# Altium schematic sheet tscnew.SchDoc
size A3
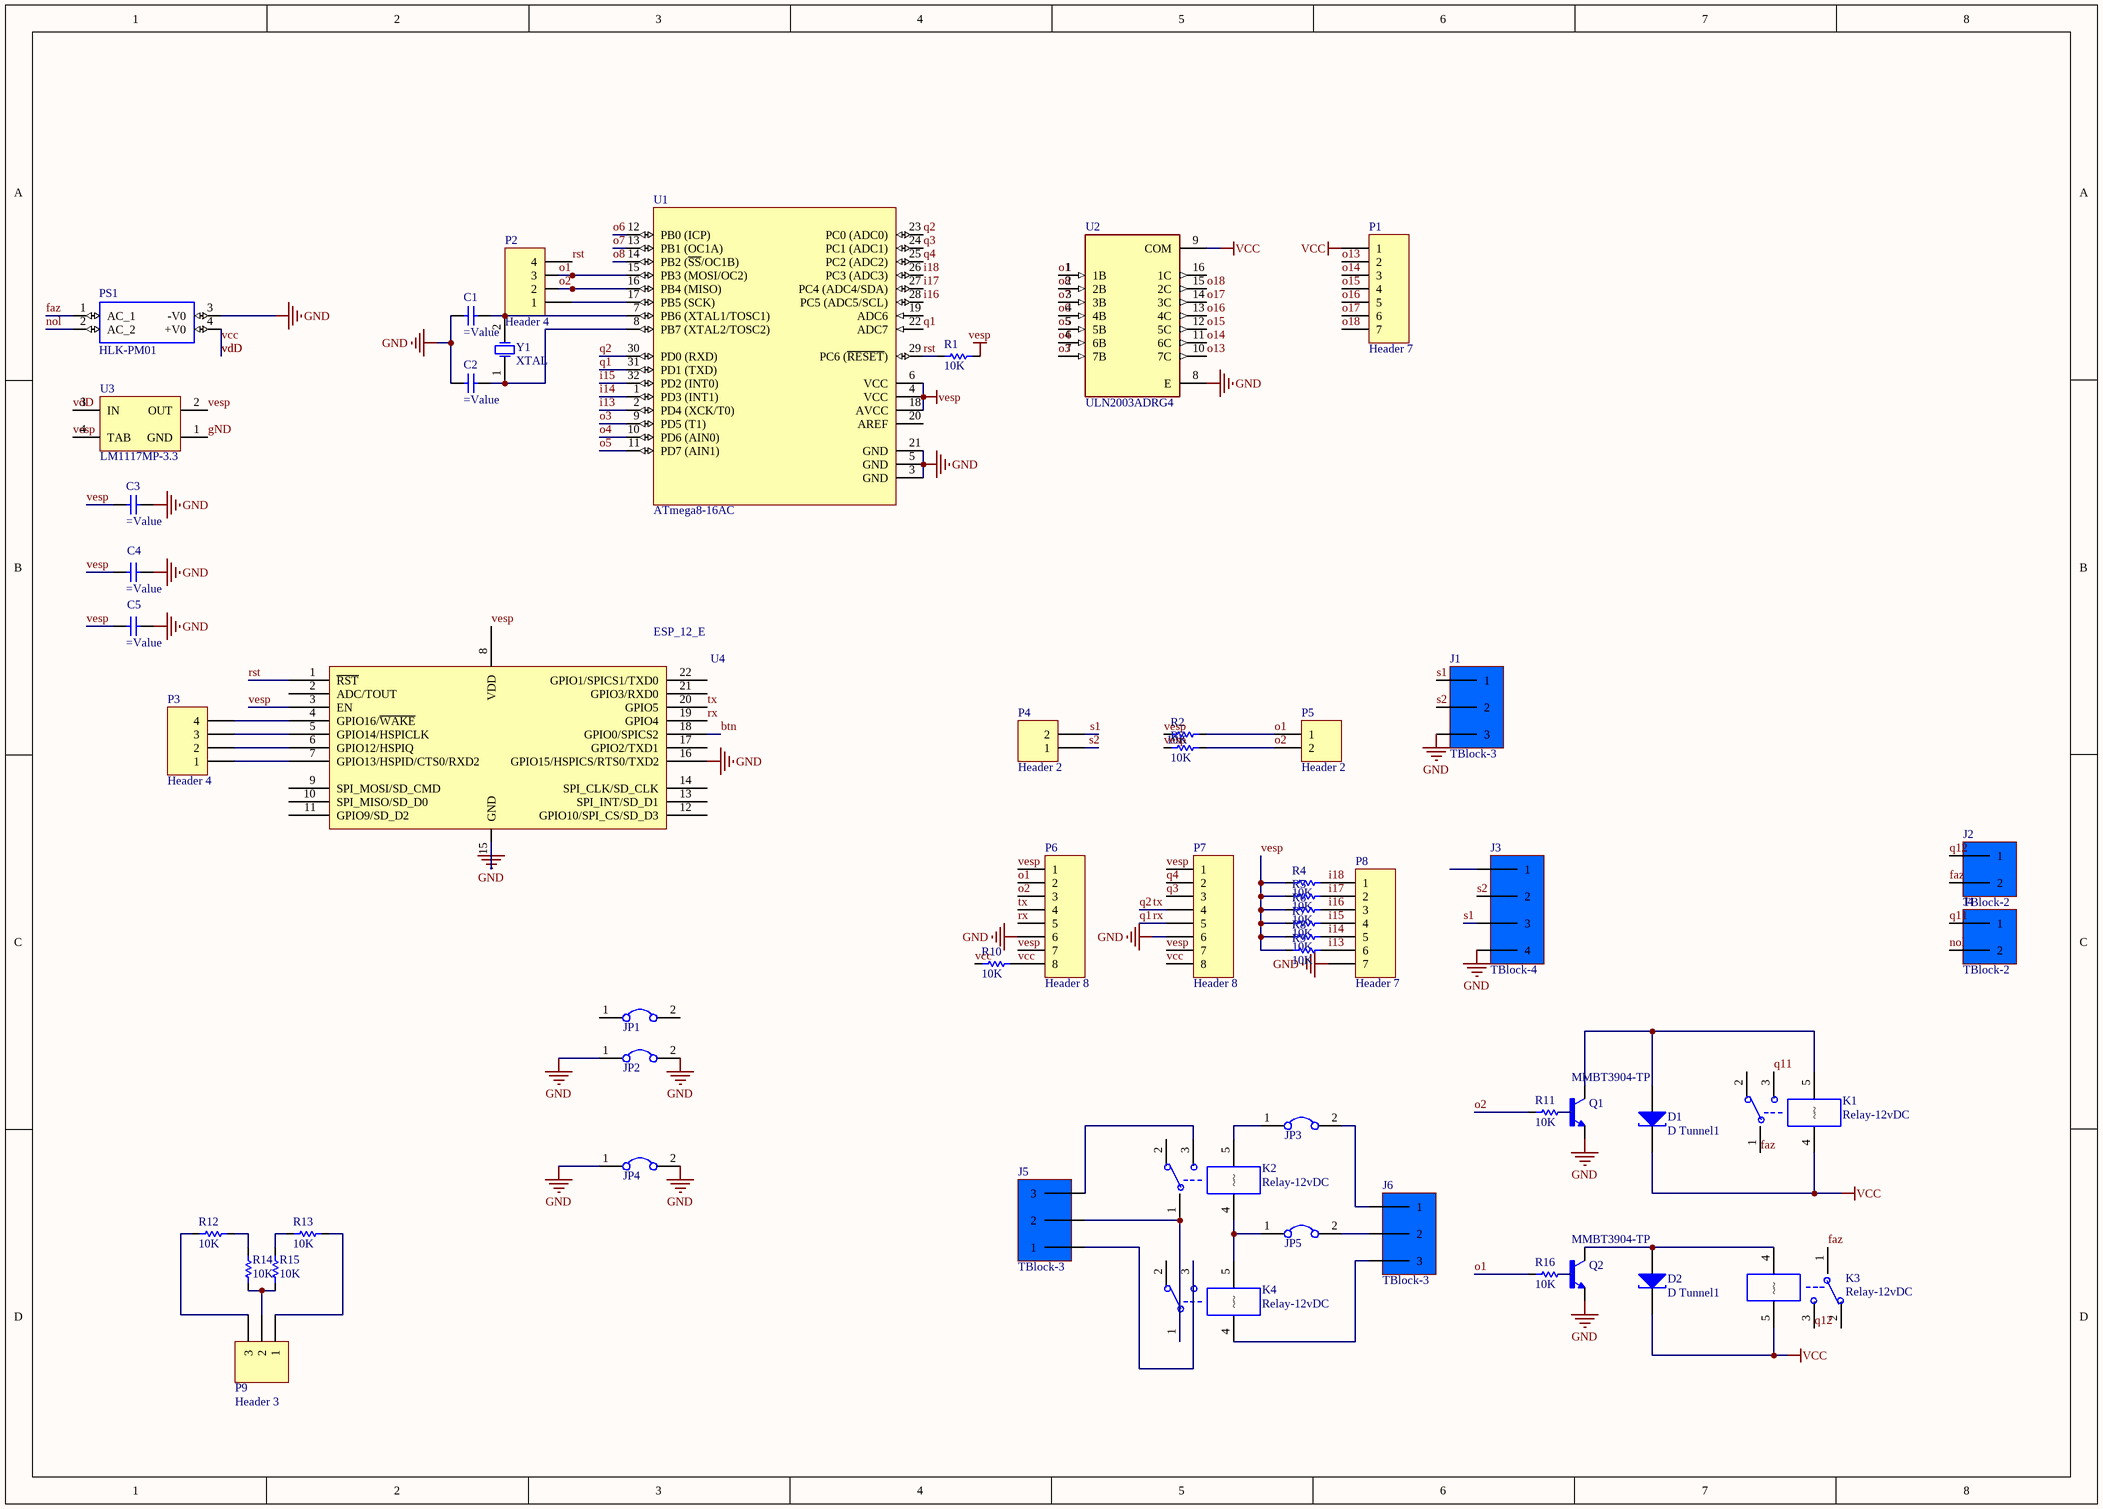
[diagram p0: tscnew.SchDoc]

## Parts
C1  (no value)  [CAP 0805]
C2  (no value)  [CAP 0805]
C3  (no value)  [CAP 0805]
C4  (no value)  [CAP 0805]
C5  (no value)  [CAP 0805]
D1  D Tunnel1  [3.2X1.6X1.1]
D2  D Tunnel1  [3.2X1.6X1.1]
J1  TBlock-3  [KF300-3 PIN]
J2  TBlock-2  [KF300-2 PIN]
J3  TBlock-4  [KF300-4 PIN]
J4  TBlock-2  [KF300-2 PIN]
J5  TBlock-3  [KF300-3 PIN]
J6  TBlock-3  [KF300-3 PIN]
JP1  Jumper  [Header 2X1]  (value not drawn)
JP2  Jumper  [Header 2X1]  (value not drawn)
JP3  Jumper  [Header 2X1]  (value not drawn)
JP4  Jumper  [Header 2X1]  (value not drawn)
JP5  Jumper  [Header 2X1]  (value not drawn)
K1  Relay-12vDC  [Relays]
K2  Relay-12vDC  [Relays]
K3  Relay-12vDC  [Relays]
K4  Relay-12vDC  [Relays]
P1  Header 7  [HDR1X7]
P2  Header 4  [HDR1X4]
P3  Header 4  [HDR1X4]
P4  Header 2  [HDR1X2]
P5  Header 2  [HDR1X2]
P6  Header 8  [HDR1X8]
P7  Header 8  [HDR1X8]
P8  Header 7  [HDR1X7]
P9  Header 3  [HDR1X3]
PS1  HLK-PM01  [HLKPM01]
Q1  MMBT3904-TP  [SOT23-3]
Q2  MMBT3904-TP  [SOT23-3]
R1  10K  [RES 1206 (3216X08L)]
R2  10K  [RES 1206 (3216X08L)]
R3  10K  [RES 0805 (2012X06L)]
R4  10K  [RES 0805 (2012X06L)]
R5  10K  [RES 0805 (2012X06L)]
R6  10K  [RES 0805 (2012X06L)]
R7  10K  [RES 0805 (2012X06L)]
R8  10K  [RES 0805 (2012X06L)]
R9  10K  [RES 0805 (2012X06L)]
R10  10K  [Res-(1/4)]
R11  10K  [RES 0805 (2012X06L)]
R12  10K  [RES 0805 (2012X06L)]
R13  10K  [RES 0805 (2012X06L)]
R14  10K  [RES 0603 (1608X06L)]
R15  10K  [RES 0603 (1608X06L)]
R16  10K  [RES 0805 (2012X06L)]
U1  ATmega8-16AC  [32A_N]
U2  ULN2003ADRG4  [SOIC127P600X175-16N]
U3  LM1117MP-3.3  [MP04A_N]
U4  ESP_12_E  [ESP_12_E]
Y1  XTAL  [R38]

## Nets
gND: C1.1(+) C2.1(+) C3.2(-) C4.2(-) C5.2(-) J1.3 J3.4 JP2.1 JP2.2 JP4.1 JP4.2 P6.6 P7.6 P8.7 PS1.3(-V0) Q1.2(E) Q2.2(E) U1.3(GND) U1.5(GND) U1.21(GND) U2.8(E) U3.1(GND) U4.15(GND) U4.16(GPIO15/HSPICS/RTS0/TXD2)
vcc: D1.2(K) D2.2(K) K1.4 K3.5 P1.1 P6.8 P7.8 PS1.4(+V0) R10.1 R10.2 U2.9(COM) U3.3(IN)  [also labelled vdD]
vesp: C3.1(+) C4.1(+) C5.1(+) P6.1 P6.7 P7.1 P7.7 R1.2 R2.1 R3.1 R4.1 R5.1 R6.1 R7.1 R8.1 R9.1 U1.4(VCC) U1.6(VCC) U1.18(AVCC) U3.2(OUT) U3.4(TAB) U4.3(EN) U4.8(VDD)
btn: U4.18(GPIO0/SPICS2)
faz: J2.2 K1.1(COM) K3.1(COM) PS1.1(AC_1)
i13: P8.6 R9.2 U1.2(PD4_(XCK/T0))
i14: P8.5 R8.2 U1.1(PD3_(INT1))
i15: P8.4 R7.2 U1.32(PD2_(INT0))
i16: P8.3 R6.2 U1.28(PC5_(ADC5/SCL))
i17: P8.2 R5.2 U1.27(PC4_(ADC4/SDA))
i18: P8.1 R4.2 U1.26(PC3_(ADC3))
nol: J4.2 PS1.2(AC_2)
o1: P2.3 P5.1 P6.2 R2.2 R16.1 U1.15(PB3_(MOSI/OC2)) U2.1(1B)
o2: P2.2 P5.2 P6.3 R3.2 R11.1 U1.16(PB4_(MISO))
o3: U1.9(PD5_(T1)) U2.7(7B)
o4: U1.10(PD6_(AIN0)) U2.6(6B)
o5: U1.11(PD7_(AIN1)) U2.5(5B)
o6: U1.12(PB0_(ICP)) U2.4(4B)
o7: U1.13(PB1_(OC1A)) U2.3(3B)
o8: U1.14(PB2_(~{SS}/OC1B)) U2.2(2B)
o13: P1.2 U2.10(7C)
o14: P1.3 U2.11(6C)
o15: P1.4 U2.12(5C)
o16: P1.5 U2.13(4C)
o17: P1.6 U2.14(3C)
o18: P1.7 U2.15(2C)
q1: P6.5 P7.5 U1.22(ADC7) U1.31(PD1_(TXD)) U4.19(GPIO4)  [also labelled rx]
q2: P6.4 P7.4 U1.23(PC0_(ADC0)) U1.30(PD0_(RXD)) U4.20(GPIO5)  [also labelled tx]
q3: P7.3 U1.24(PC1_(ADC1))
q4: P7.2 U1.25(PC2_(ADC2))
q11: J4.1 K1.3(NO)
q12: J2.1 K3.3(NO)
rst: P2.4 R1.1 U1.29(PC6_(~{RESET})) U4.1(~{RST})
s1: J1.1 J3.3 P4.2
s2: J1.2 J3.2 P4.1
NetC1_2: C1.2(-) U1.7(PB6_(XTAL1/TOSC1)) Y1.2(OSC2)
NetC2_2: C2.2(-) U1.8(PB7_(XTAL2/TOSC2)) Y1.1(OSC1)
NetD1_1: D1.1(A) K1.5 Q1.3(C)
NetD2_1: D2.1(A) K3.4 Q2.3(C)
NetJ5_1: J5.1 K4.3(NO)
NetJ5_2: J5.2 K2.1(COM) K4.1(COM)
NetJ5_3: J5.3 K2.3(NO)
NetJ6_1: J6.1 JP3.2
NetJ6_2: J6.2 JP5.2
NetJ6_3: J6.3 K4.4
NetJP3_1: JP3.1 K2.5
NetJP5_1: JP5.1 K2.4 K4.5
NetP2_1: P2.1 U1.17(PB5_(SCK))
NetP3_1: P3.1 U4.7(GPIO13/HSPID/CTS0/RXD2)
NetP3_2: P3.2 U4.6(GPIO12/HSPIQ)
NetP3_3: P3.3 U4.5(GPIO14/HSPICLK)
NetP3_4: P3.4 U4.4(GPIO16/~{WAKE})
NetP9_1: P9.1 R13.2
NetP9_2: P9.2 R14.1 R15.1
NetP9_3: P9.3 R12.1
NetQ1_1: Q1.1(B) R11.2
NetQ2_1: Q2.1(B) R16.2
NetR12_2: R12.2 R14.2
NetR13_1: R13.1 R15.2

Not connected (* = marked no-connect by the designer): J3 1; JP1 1 2; K1 2(NC); K2 2(NC); K3 2(NC); K4 2(NC); U1 19(ADC6) 20(AREF); U2 16(1C); U4 2(ADC/TOUT) 9(SPI_MOSI/SD_CMD) 10(SPI_MISO/SD_D0) 11(GPIO9/SD_D2) 12(GPIO10/SPI_CS/SD_D3) 13(SPI_INT/SD_D1) 14(SPI_CLK/SD_CLK) 17(GPIO2/TXD1) 21(GPIO3/RXD0) 22(GPIO1/SPICS1/TXD0)

## Library data of the parts
C1-C5 = Capacitor
D1 D2 = D Tunnel1: Tunnel Diode - RLC Model; Published: 8-Jun-2000; LatestRevisionDate: 17-Jul-2002; LatestRevisionNote: Re-released for DXP Platform.; PackageVersion: Feb-2002; PackageReference: 3.2X1.6X1.1; Publisher: Altium Limited; PackageDescription: SM LED; 2 Flat Leads
K1-K4 = Relay-05vDC: Relay-05vDC-240AC 5A; Designer: Seyed Mohsen Ghasemain; ComponentLinkURL: www.picpars.com
P1 P8 = Header 7: Header, 7-Pin; LatestRevisionDate: 17-Jul-2002; LatestRevisionNote: Re-released for DXP Platform.; Publisher: Altium Limited
P2 P3 = Header 4: Header, 4-Pin; LatestRevisionDate: 17-Jul-2002; LatestRevisionNote: Re-released for DXP Platform.; Publisher: Altium Limited
P4 P5 = Header 2: Header, 2-Pin; LatestRevisionDate: 17-Jul-2002; LatestRevisionNote: Re-released for DXP Platform.; Publisher: Altium Limited
P6 P7 = Header 8: Header, 8-Pin; LatestRevisionDate: 17-Jul-2002; LatestRevisionNote: Re-released for DXP Platform.; Publisher: Altium Limited
P9 = Header 3: Header, 3-Pin; LatestRevisionDate: 17-Jul-2002; LatestRevisionNote: Re-released for DXP Platform.; Publisher: Altium Limited
PS1 = HLK-PM01: <b>Ultra-compact power module</b><p> Source: <a href="https://datasheet.lcsc.com/szlcsc/1906201102_HI-LINK-HLK-PM03_C209904.pdf"> Datasheet </a>; Package: Package Analog Devices; MF: Hi-link; Availability: Unavailable; Value: *; MP: hlk-pm01; Price: None; SnapEDA_Link: https://www.snapeda.com/parts/hlk-pm01/Hi-link/view-part/2875605/?ref=snap
Q1 Q2 = MMBT3904-TP: Bipolar _BJT_ Transistor NPN 40V 200mA 300MHz 350mW Surface Mount SOT-23; MF: Micro Commercial; Value: *; MP: MMBT3904-TP; Package: SOT-23 Micro Commercial; Price: None; Availability: Unavailable; SnapEDA_Link: https://www.snapeda.com/parts/MMBT3904-TP/Micro%20Commercial/view-part/805928/?ref=snap
R1-R16 = Resistor: Tolerance: 5%; Power: 1/4 W; Value: 10K
U1 = ATmega8-16AC: 8-Bit AVR Microcontroller with 8K Bytes of In-System Programmable Flash Memory; Published: 17-Sep-2003; LatestRevisionDate: 16-Oct-2006; LatestRevisionNote: IPC-7351 Footprint Added.; DatasheetVersion: 2486H-AVR-09/02; PackageVersion: revB, Oct-2001; PackageReference: 32A; Publisher: Altium Limited; PackageDescription: 32-Lead, 7x7x1.0 mm Body, 0.8mm Lead Pitch, Thin Profile Plastic Quad Flat Package (TQFP); Supplier 1: Digi-Key; Supplier Part Number 1: ATMEGA8-16AC-ND; Supplier 2: Mouser; Supplier Part Number 2: 556-ATMEGA8-16AC; Code_JEDEC: MS-026-ABA; ComponentLink1Description: Datasheet; ComponentLink1URL: http://www.atmel.com/dyn/resources/prod_documents/doc2486.pdf; ComponentLink2Description: Atmel.com Home; ComponentLink2URL: http://www.atmel.com
U2 = ULN2003ADRG4: 50-V, 7-ch darlington transistor array, -20C to 70C 16-SOIC -40 to 70; Price: None; MP: ULN2003ADRG4; Availability: Unavailable; Package: None; Value: *
U3 = LM1117MP-3.3: 800mA Low-Dropout Linear Regulator; Manufacturer: National Semiconductor; CompType: LDO IC; PackageTopMarking: XYTT*N05A; PowerWise: N; Published: 4-Dec-2008; DatasheetVersion: Apr-2006; PackageVersion: revB, Apr-2003; PackageReference: MP04A; Publisher: Altium Limited; PackageDescription: Molded SOT-223, 6.50 x 3.56 x 1.6mm Body, 4 Lead, 2.3mm Pitch; PartNumber: LM1117MP-3.3; RoHS: O; PinCount: 4; DigiKeyPartNumber: LM1117MP-3.3CT-ND; Code_JEDEC: TO-261-AA; Code_IPC: SOT223-4; ComponentLink1Description: LM1117 Datasheet; ComponentLink1URL: http://www.national.com/ds/LM/LM1117.pdf; ComponentLink2Description: LM1117 Web Page; ComponentLink2URL: http://www.national.com/pf/LM/LM1117.html; ComponentLink3Description: MP04A Package Page; ComponentLink3URL: http://www.national.com/packaging/folders/mp04a.html
U4 = ESP_12_E: ESP-12 Wi-Fi Module by AI-Thinker; IC: ESP8266-EX; Vendor: Ai-thinker
Y1 = XTAL: Crystal Oscillator; Published: 8-Jun-2000; LatestRevisionDate: 17-Jul-2002; LatestRevisionNote: Re-released for DXP Platform.; PackageReference: R38; Publisher: Altium Limited; PackageDescription: Crystal, Thru-Hole; 2 Leads; Body 3.1 x 8.2 mm (Dia.xH)